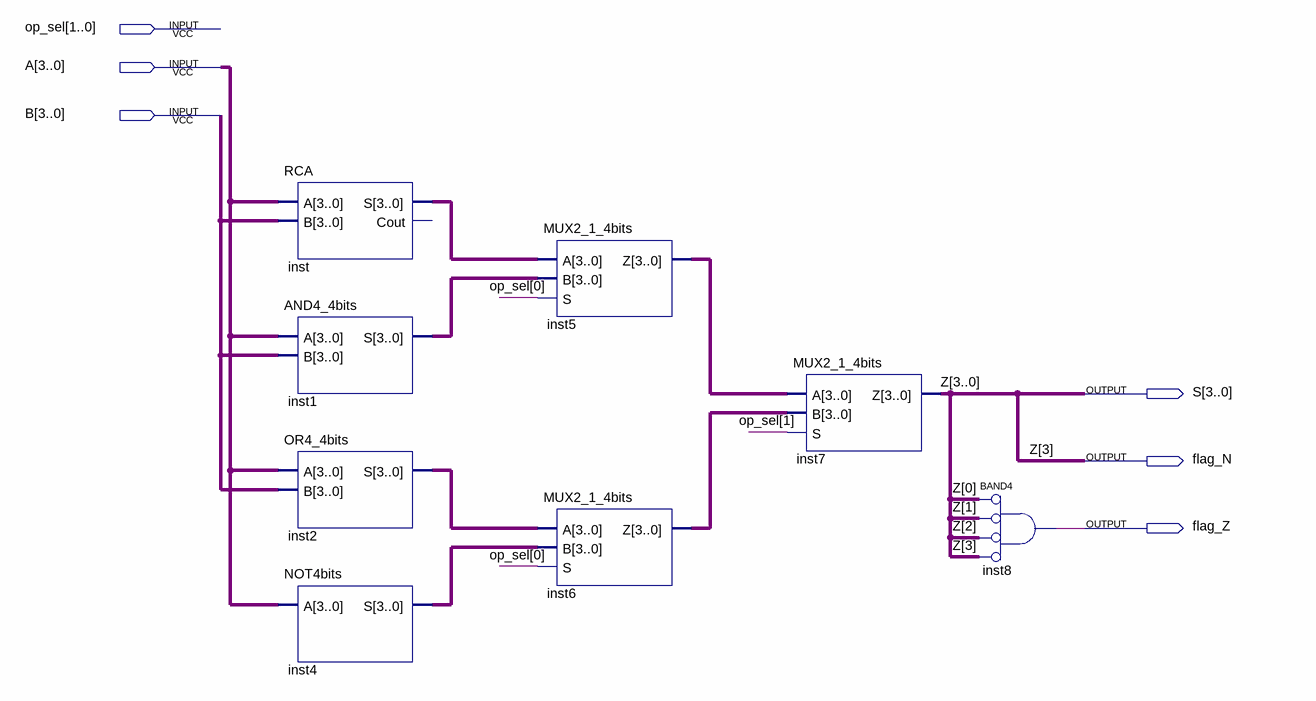
[diagram p0: schematic sheet]
// Quartus schematic ULA.bdf as structural Verilog: 8 symbols, 6 pins
module ULA (
  input  [1:0] op_sel,
  input  [3:0] A,
  input  [3:0] B,
  output [3:0] S,
  output flag_N,
  output flag_Z
);

  wire [3:0] inst1_s, inst2_s, inst4_s, inst5_z, inst6_z, inst_s;

  RCA inst (.A(A), .B(B), .S(inst_s));  // open: Cout
  AND4_4bits inst1 (.A(A), .B(B), .S(inst1_s));
  OR4_4bits inst2 (.A(A), .B(B), .S(inst2_s));
  NOT4bits inst4 (.A(A), .S(inst4_s));
  MUX2_1_4bits inst5 (.A(inst_s), .B(inst1_s), .S(op_sel[0]), .Z(inst5_z));
  MUX2_1_4bits inst6 (.A(inst2_s), .B(inst4_s), .S(op_sel[0]), .Z(inst6_z));
  MUX2_1_4bits inst7 (.A(inst5_z), .B(inst6_z), .S(op_sel[1]), .Z({flag_N, S[2:0]}));
  and inst8 (flag_Z, ~S[0], ~S[1], ~S[2], ~flag_N);  // BAND4

  assign S[3] = flag_N;

  // Other names for the same wires on the sheet: Z[3:0] = {flag_N, S[2:0]}
endmodule
